# Altium schematic sheet Condor2a_Herlink.SchDoc
size A4
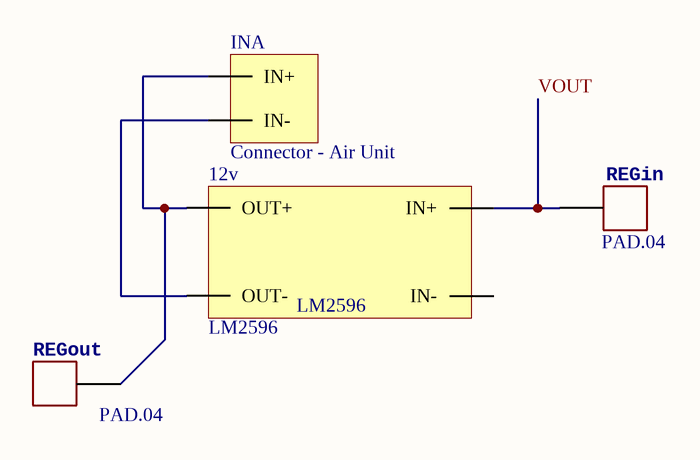
[diagram p0: Condor2a_Herlink.SchDoc]

## Parts
12v  LM2596  [LM2596 DC-DC HW-411]
INA  Connector - Air Unit  [Connector - Air Unir]
REGin  PAD.04  [PAD.04X.04]
REGout  PAD.04  [PAD.04X.04]

## Nets
VOUT: 12v.IN+ REGin.P$1
Net12v_OUT+: 12v.OUT+ INA.1(IN+) REGout.P$1
Net12v_OUT-: 12v.OUT- INA.2(IN-)

Not connected (* = marked no-connect by the designer): 12v IN-